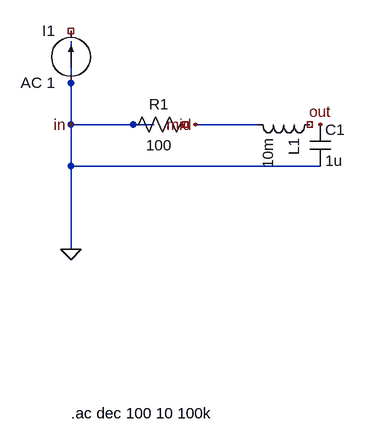
[diagram p0: schematic test02_rlc_series.asc]
test02_rlc_series.asc, the LTspice schematic file:
Version 4
SHEET 1 880 736
WIRE 0 64 0 384
WIRE 128 192 0 192
WIRE 288 192 192 192
WIRE 384 256 0 256
WIRE 0 256 0 384
FLAG 0 384 0
FLAG 0 192 in
FLAG 192 192 mid
FLAG 384 192 out
SYMBOL current 0 128 R180
WINDOW 0 24 80 Left 2
WINDOW 3 24 0 Left 2
SYMATTR InstName I1
SYMATTR Value AC 1
SYMBOL res 192 176 R90
WINDOW 0 0 56 VBottom 2
WINDOW 3 32 56 VTop 2
SYMATTR InstName R1
SYMATTR Value 100
SYMBOL ind 384 176 R90
SYMATTR InstName L1
SYMATTR Value 10m
SYMBOL cap 368 192 R0
SYMATTR InstName C1
SYMATTR Value 1u
TEXT 0 636 Left 2 !.ac dec 100 10 100k

The netlist it stands for:
* test02_rlc_series.asc
I1 0 NC_01 AC 1
R1 NC_02 0 100
L1 NC_03 mid 10m
C1 out 0 1u
.ac dec 100 10 100k
.backanno
.end